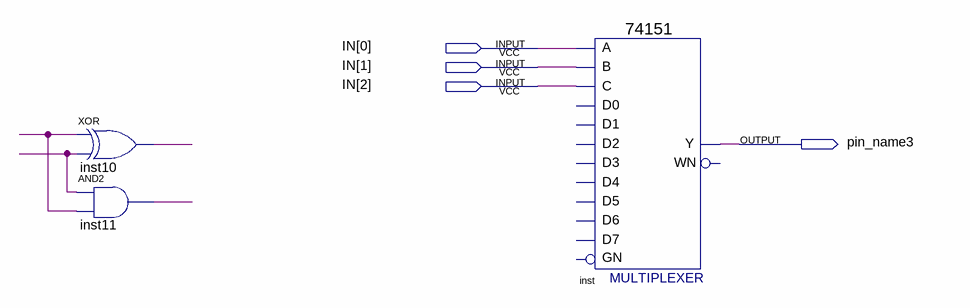
[diagram p0: schematic sheet]
// Quartus schematic alu.bdf as structural Verilog: 3 symbols, 4 pins
module alu (
  input  [2:0] IN,
  output pin_name3
);

  wire inst10_out, inst11_out, undriven, undriven_2;

  xor inst10 (inst10_out, undriven_2, undriven);
  and inst11 (inst11_out, undriven, undriven_2);
  \74151  inst (.C(IN[2]), .B(IN[1]), .A(IN[0]), .Y(pin_name3));  // open: GN, D5, D0, D1, D4, D3, D2, D6, D7, WN
endmodule
